# EAGLE design internal_breakout (EAGLE 9.6.1)
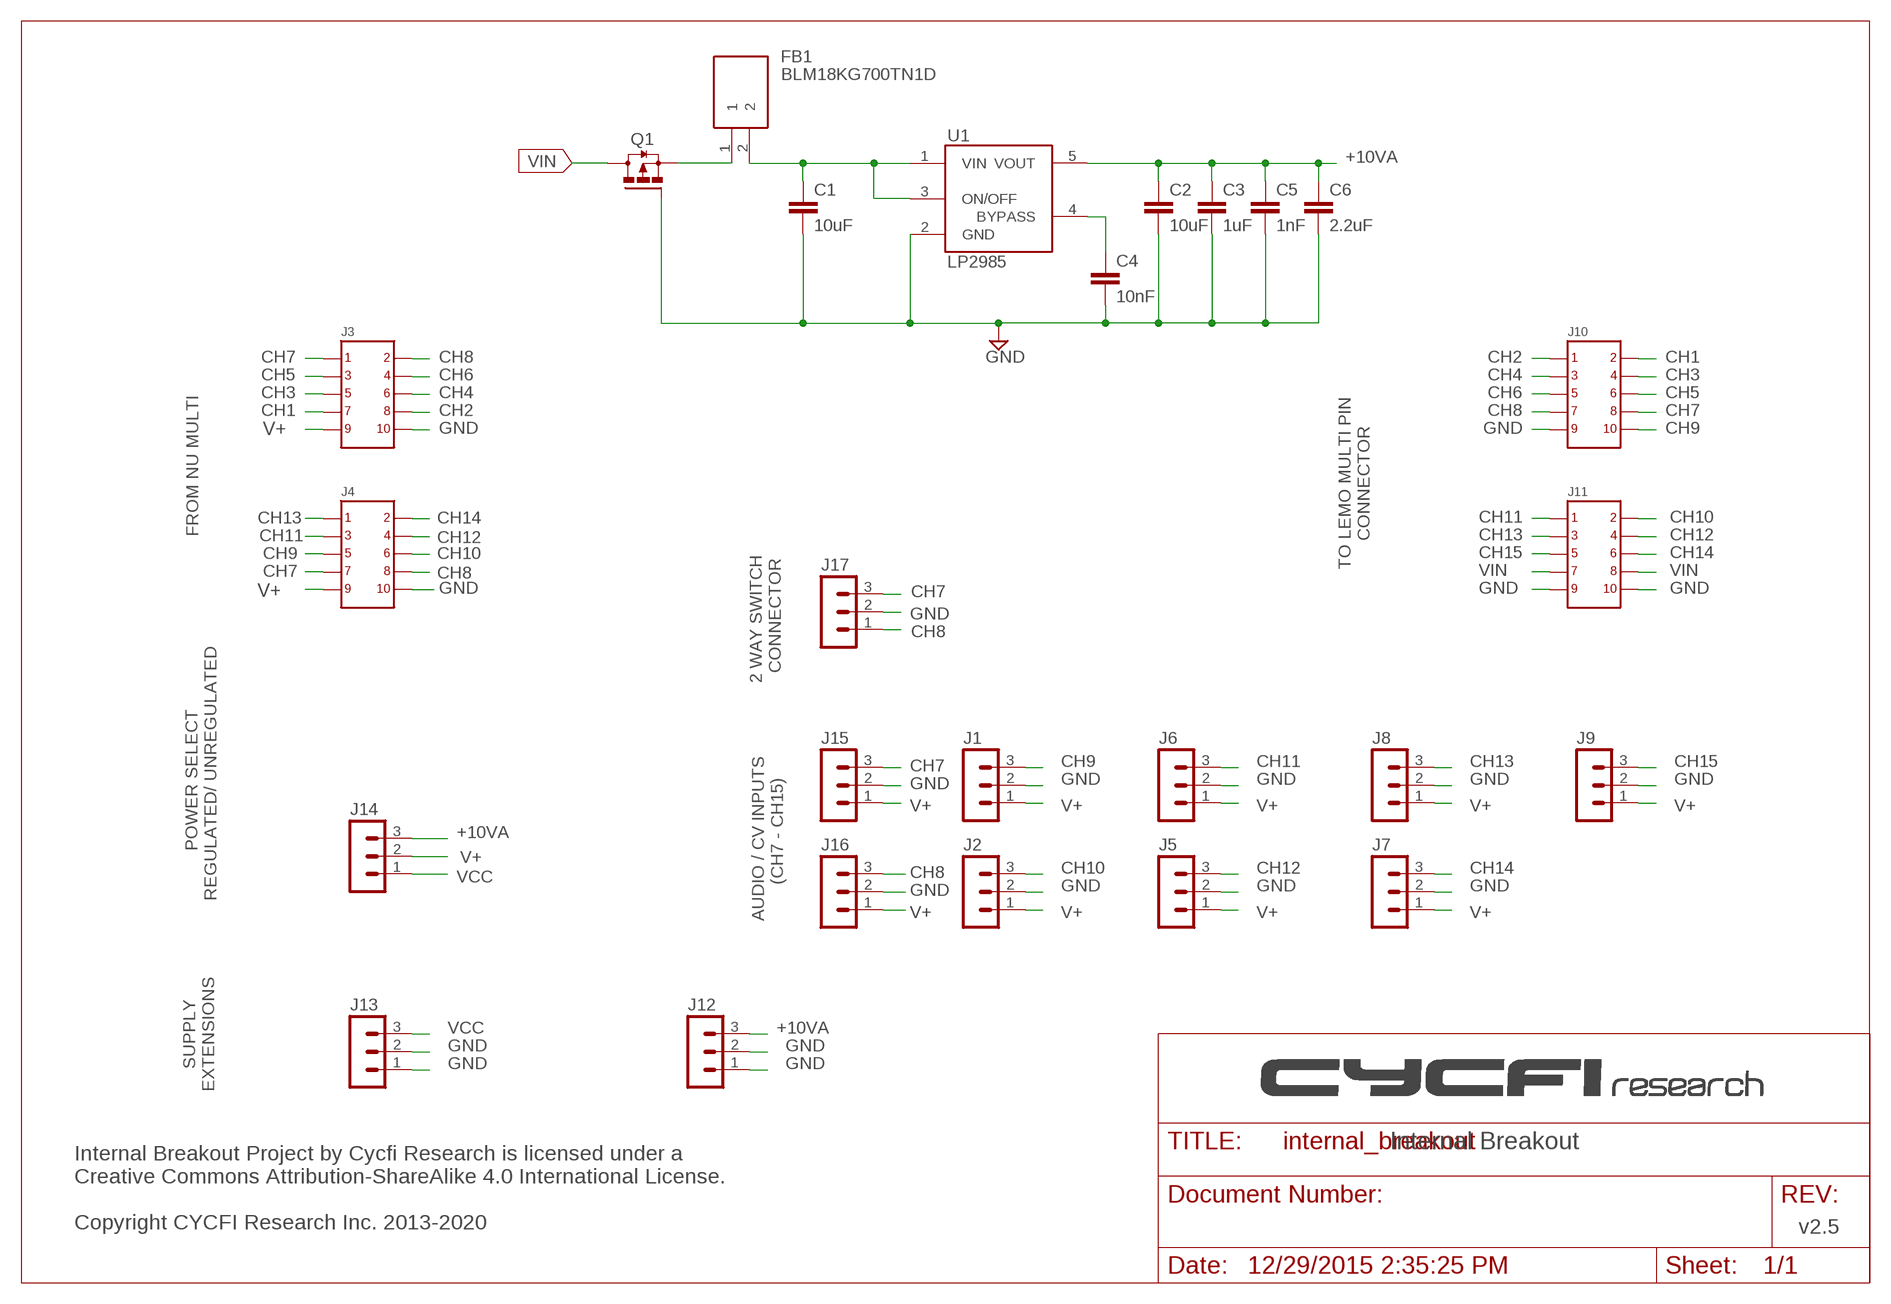
[diagram p0: schematic, sheet 1]

## Parts
C1  10uF  C-EUC0603  [C0603]
C2  10uF  C-EUC0603  [C0603]
C3  1uF  C-EUC0603  [C0603]
C4  10nF  C-EUC0402  [C0402]
C5  1nF  C-EUC0402  [C0402]
C6  2.2uF  C-EUC0603  [C0603]
FB1  BLM18KG700TN1D  [BEADC1608X75N]
J1  MA03-1  [MA03-1]
J2  MA03-1  [MA03-1]
J3  2X5  [2X5]
J4  2X5  [2X5]
J5  MA03-1  [MA03-1]
J6  MA03-1  [MA03-1]
J7  MA03-1  [MA03-1]
J8  MA03-1  [MA03-1]
J9  MA03-1  [MA03-1]
J10  2X5  [2X5]
J11  2X5  [2X5]
J12  MA03-1  [MA03-1]
J13  MA03-1  [MA03-1]
J14  MA03-1  [MA03-1]
J15  MA03-1  [MA03-1]
J16  MA03-1  [MA03-1]
J17  MA03-1  [MA03-1]
Q1  DMP3099L  FDN360P  [SUPER-SOT3]
U1  LP2985  LP2985AIM5-3.3  [SOT25]

## Nets
+10VA: C2.1 C3.1 C5.1 C6.1 J12.3 J14.3 U1.5(VOUT)
BYPASS: C4.1 U1.4(BYPASS)
CH1: J3.7 J10.2
CH2: J3.8 J10.1
CH3: J3.5 J10.4
CH4: J3.6 J10.3
CH5: J3.3 J10.6
CH6: J3.4 J10.5
CH7: J3.1 J4.7 J10.8 J15.3 J17.3
CH8: J3.2 J4.8 J10.7 J16.3 J17.1
CH9: J1.3 J4.5 J10.10
CH10: J2.3 J4.6 J11.2
CH11: J4.3 J6.3 J11.1
CH12: J4.4 J5.3 J11.4
CH13: J4.1 J8.3 J11.3
CH14: J4.2 J7.3 J11.6
CH15: J9.3 J11.5
GND: C1.2 C2.2 C3.2 C4.2 C5.2 C6.2 J1.2 J2.2 J3.10 J4.10 J5.2 J6.2 J7.2 J8.2 J9.2 J10.9 J11.9 J11.10 J12.1 J12.2 J13.1 J13.2 J15.2 J16.2 J17.2 Q1.1(G) U1.2(GND)
N$1: FB1.1 Q1.2(S)
V+: J1.1 J2.1 J3.9 J4.9 J5.1 J6.1 J7.1 J8.1 J9.1 J14.2 J15.1 J16.1
VCC: C1.1 FB1.2 J13.3 J14.1 U1.1(VIN) U1.3(ON/OFF)
VIN: J11.7 J11.8 Q1.3(D)

## Notes on the sheet
- CH7 | CH8
- CH5 | CH6
- CH3 | CH4
- CH1 | CH2
- GND
- TO LEMO MULTI PIN
  CONNECTOR
- FROM NU MULTI
- GND
- 2 WAY SWITCH 
    CONNECTOR
- AUDIO / CV INPUTS
     (CH7 - CH15)
- POWER SELECT 
  REGULATED/ UNREGULATED
- SUPPLY
  EXTENSIONS
- Internal Breakout
- Internal Breakout Project by Cycfi Research is licensed under a 
  Creative Commons Attribution-ShareAlike 4.0 International License. 
  
  Copyright CYCFI Research Inc. 2013-2020
- v2.5
- 12/29/2015 2:35:25 PM

## Library data of the parts
C1-C6 = rcl:C-EU: CAPACITOR, European symbol; SPICEPREFIX: C
FB1 = SamacSys_Parts:BLM18KG700TN1D: BLM18_N1D Series EMI Suppression Filter 70+/-25% at 100MHz 3.5A @85 Source: Datasheet <https://componentsearchengine.com/Datasheets/1/BLM18KG700TN1D.pdf>; DESCRIPTION: BLM18_N1D Series EMI Suppression Filter 70+/-25% at 100MHz 3.5A @85; HEIGHT: 0.75mm; MANUFACTURER_NAME: Murata Electronics; MANUFACTURER_PART_NUMBER: BLM18KG700TN1D; MOUSER_PART_NUMBER: 81-BLM18KG700TN1D; MOUSER_PRICE-STOCK: https://www.mouser.com/Search/Refine.aspx?Keyword=81-BLM18KG700TN1D
J1 J2 J5-J9 J12-J17 = con-lstb:MA03-1: PIN HEADER; OC_FARNELL: unknown; OC_NEWARK: unknown
J3 J4 J10 J11 = headers(2mm):2X5
Q1 = transistor-power:FDN360P: Single P-Channel, PowerTrench (R) MOSFET Source: http://www.fairchildsemi.com/ds/FD/FDN360P.pdf
U1 = LP2985:LP2985: LP2985-N Micropower 150 mA Low-Noise Ultra Low-Dropout Regulator

## Board
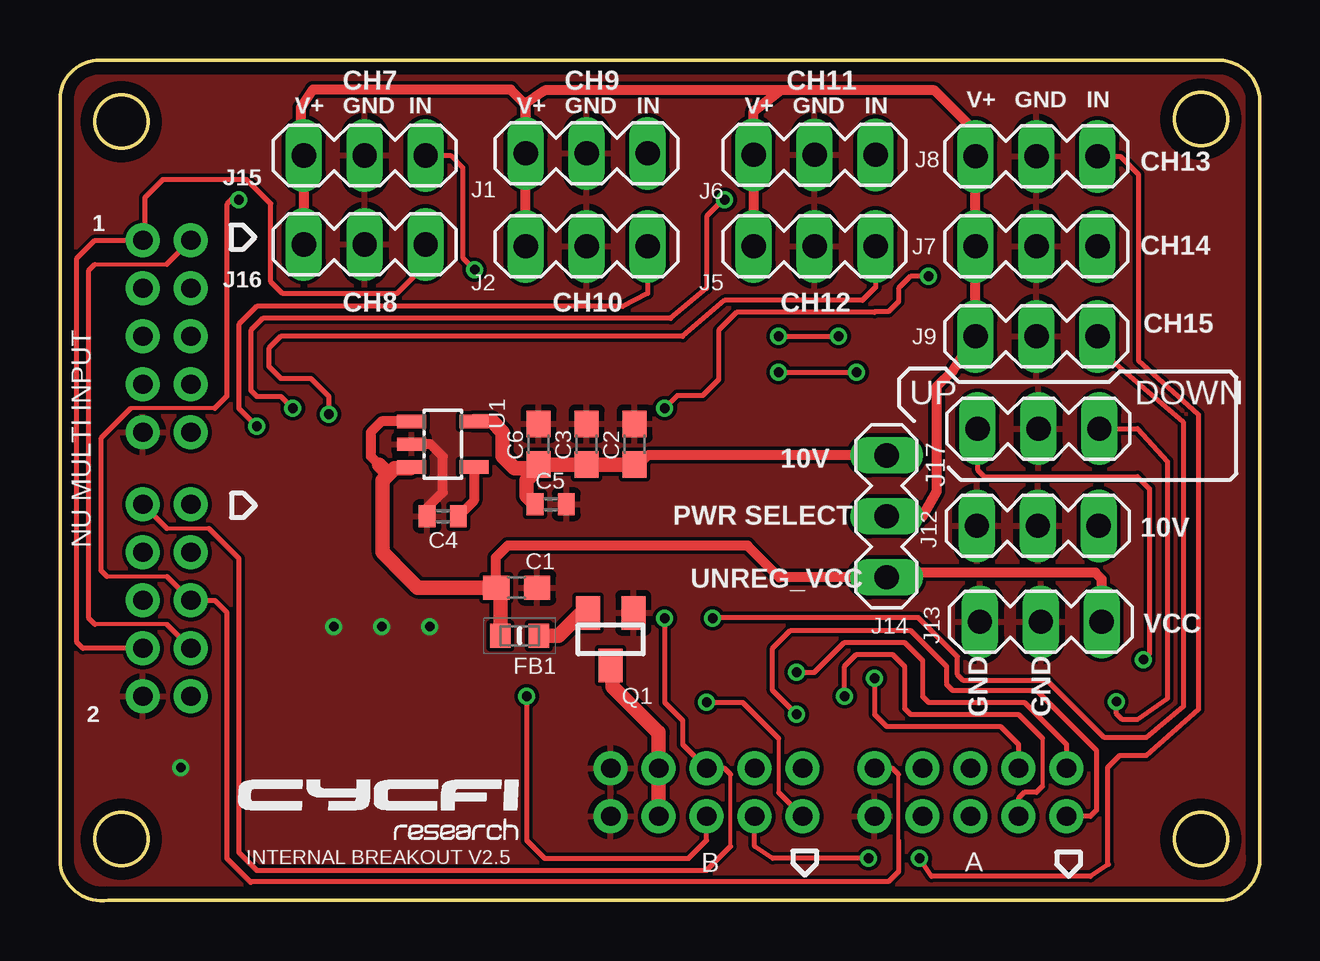
[diagram p1: board, top side]
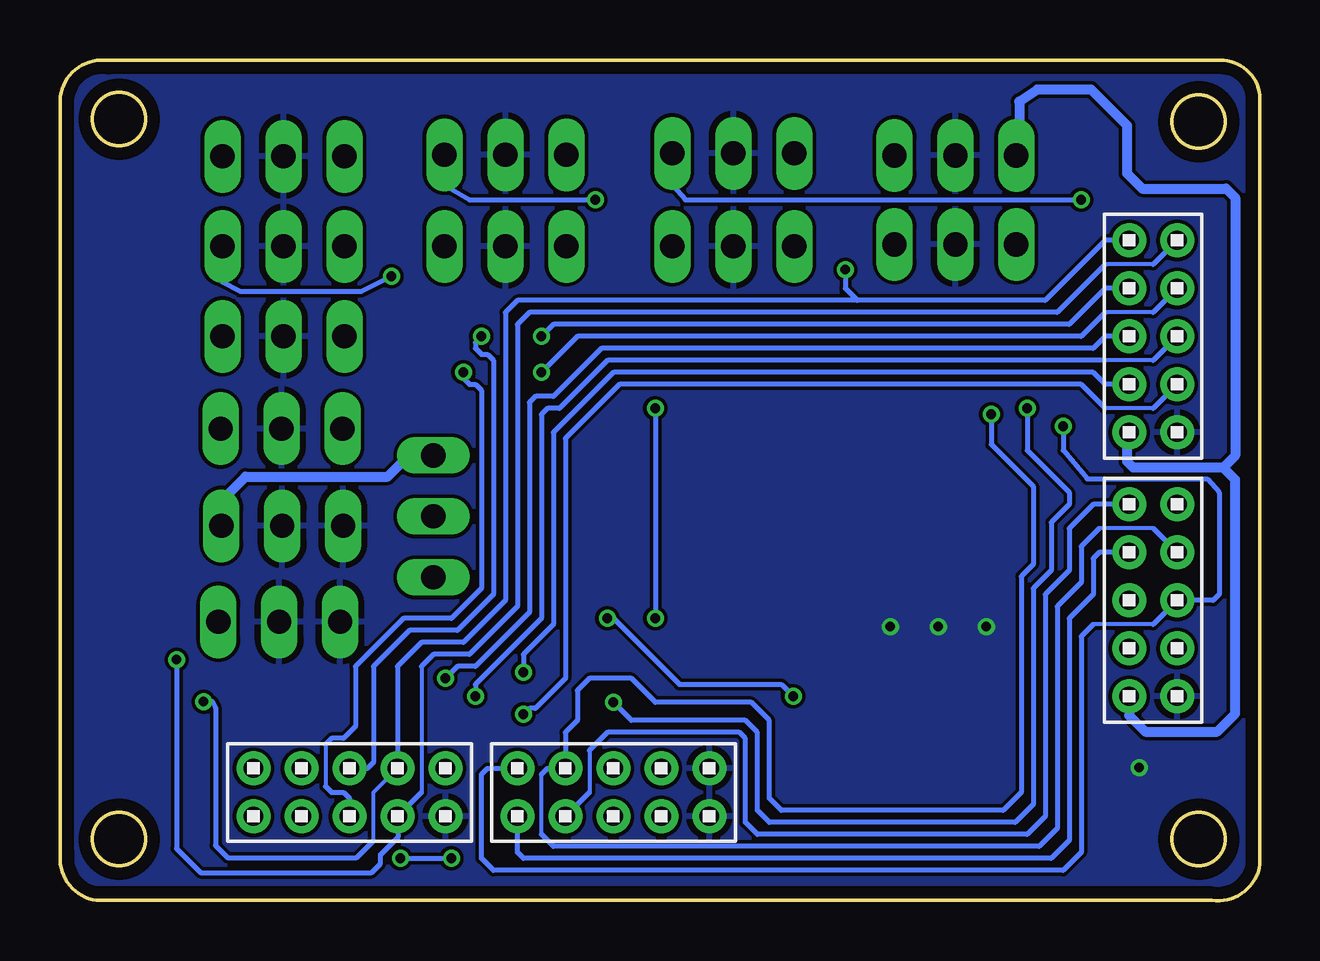
[diagram p2: board, bottom side, seen from below]

Size 50.02 x 35.03 mm. Coordinates in mm from the lower left corner, seen from the top.
Outline: 1.5,35.02 48,35.02 arc-90 50,33.52 50,2.02 arc-90 48.5,0.02 2,0.02 arc-90 0,1.52 0,33.27 arc-90 1.5,35.02
Outline: circle at 2.55,32.47 radius 1.1
Outline: circle at 2.55,2.57 radius 1.1
Outline: circle at 47.55,32.57 radius 1.1
Outline: circle at 47.55,2.57 radius 1.1
Copper layers (1*16): Top 0.035mm / dielectric 1.6mm / Bottom 0.035mm
Design rules "Elecrow_2-layer_PCB_eagle_rule": minimum track width 6mil, minimum drill 12mil, track to track 6mil, track to pad 8mil, pad to pad 12mil, via to via 12mil, smd to smd 0mil, copper to edge 20mil, drill to drill 10mil, minimum pad ring 6mil, minimum via ring 6mil, stop-mask expansion 0mil, vias tented up to drill 100mil, thermal gap 10mil

### Footprints (pad centres in the part's own frame; a part is rotated, then mirrored left to right if it is on the bottom)
C0603 = smd 1.1 x 1: 1 -0.85,0; 2 0.85,0
C0402 = smd 0.7 x 0.9: 1 -0.65,0; 2 0.65,0
BEADC1608X75N = smd 0.85 x 1: 1 -0.8,0; 2 0.8,0
MA03-1 = drill 1.016 long: 1 -2.54,0; 2 0,0; 3 2.54,0
2X5 = drill 0.8 pad 1.422: 1 -4,-1; 2 -4,1; 3 -2,-1; 4 -2,1; 5 0,-1; 6 0,1; 7 2,-1; 8 2,1; 9 4,-1; 10 4,1
SUPER-SOT3 = smd 1 x 1.4: 1 -0.95,-1.1; 2 0.95,-1.1; 3 0,1.1
SOT25 = smd 0.55 x 1.2: 1 -0.95,-1.3; 2 0,-1.3; 3 0.95,-1.3; 4 0.95,1.3; 5 -0.95,1.3

### Placement (x,y rotation side)
C1  19.03,13.04 0 top
C2  23.95,19.02 90 top
C3  21.95,19.02 90 top
C4  15.95,16.02 180 top
C5  20.45,16.52 0 top
C6  19.95,19.02 90 top
FB1  19.16,11.04 180 top
J1  21.95,31.15 0 top
J2  21.95,27.27 0 top
J3  4.45,23.52 270 bottom
J4  4.45,12.52 270 bottom
J5  31.45,27.27 0 top
J6  31.45,31.08 0 top
J7  40.7,27.27 0 top
J8  40.7,31.02 0 top
J9  40.7,23.52 0 top
J10  37.95,4.52 0 bottom
J11  26.95,4.52 0 bottom
J12  40.76,15.62 0 top
J13  40.88,11.62 0 top
J14  34.45,16.02 90 top
J15  12.7,31.05 0 top
J16  12.7,27.35 0 top
J17  40.78,19.67 0 top
Q1  22.95,10.9 180 top
U1  15.95,19.02 270 top

### Tracks (layer width: path | path; a pad name or v marks a point on that pad's centre or on a via)
+10VA
  Top 0.406: 24.1,18.17 24.49,18.56 J14.3
  Top 0.61: U1.5 18,19.97 18.45,19.52 18.45,18.52 18.95,18.02 19.8,18.02 C6.1 | C6.1 C3.1 C2.1 24.1,18.17 | C6.1 19.95,18.02 19.45,17.52 19.45,16.87 C5.1
  Bottom 0.406: J14.3 34.47,18.54 34.89,18.54 34.91,18.52 35.51,18.52 | 35.51,18.52 35.53,18.54 | J12.3 43.3,16.65 42.28,17.67 36.36,17.67 35.51,18.52
BYPASS
  Top 0.406: U1.4 17.25,16.67 C4.1
CH1  (via drill 0.4)
  Top 0.203: v30.7,9.52 31.45,9.52 32.7,10.77 35.2,10.77 35.95,10.02 35.95,8.52 36.2,8.27 40.2,8.27 41.95,6.52 J10.2
  Bottom 0.203: J3.7 6.45,21.52 6.95,22.02 26.95,22.02 29.45,19.52 29.45,11.52 30.7,10.27 v30.7,9.52
CH2  (via drill 0.4)
  Top 0.203: v30.7,7.77 29.7,8.77 29.7,10.52 30.45,11.27 35.45,11.27 36.95,9.77 36.95,9.02 37.2,8.77 40.7,8.77 43.2,6.27 43.2,3.77 42.95,3.52 J10.1
  Bottom 0.17: 4.45,20.52 6.45,20.52
  Bottom 0.203: J3.8 4.45,20.52 | 6.45,20.52 7.45,21.52 26.7,21.52 28.95,19.27 28.95,9.27 30.2,8.02 30.45,8.02 v30.7,7.77
CH3  (via drill 0.4)
  Top 0.203: v33.95,9.27 33.95,7.77 34.45,7.27 39.2,7.27 39.95,6.52 J10.4
  Bottom 0.203: J3.5 6.45,23.52 6.95,23.02 27.45,23.02 29.45,21.02 30.2,21.02 30.45,20.77 30.45,12.02 32.7,9.77 33.45,9.77 v33.95,9.27
CH4  (via drill 0.4)
  Top 0.17: 40.95,6.77 40.95,4.77
  Top 0.203: v32.7,8.52 32.7,9.77 33.2,10.27 34.7,10.27 35.2,9.77 35.2,8.02 35.45,7.77 39.95,7.77 40.95,6.77 | 40.95,4.77 40.7,4.52 40.2,4.52 39.95,4.27 J10.3
  Bottom 0.17: 4.45,22.52 6.45,22.52
  Bottom 0.203: J3.6 4.45,22.52 | v32.7,8.52 32.7,9.02 29.95,11.77 29.95,20.27 29.7,20.52 29.2,20.52 27.2,22.52 6.45,22.52
CH5  (via drill 0.4)
  Top 0.203: v29.95,23.52 v32.45,23.52
  Bottom 0.203: J3.3 6.45,25.52 7.95,24.02 29.45,24.02 v29.95,23.52 | v32.45,23.52 32.7,23.27 32.7,23.02 32.45,22.77 32.2,22.77 31.95,22.52 31.95,12.77 33.45,11.27 35.45,11.27 36.95,9.77 36.95,5.77 37.2,5.52 J10.6
CH6  (via drill 0.4)
  Top 0.203: v29.95,22.02 v33.2,22.02
  Bottom 0.17: 38.95,6.52 38.95,4.77 | 4.45,24.52 6.45,24.52
  Bottom 0.203: J3.4 4.45,24.52 | 6.45,24.52 7.45,23.52 28.45,23.52 v29.95,22.02 | v33.2,22.02 33.2,21.77 32.95,21.52 32.7,21.52 32.45,21.27 32.45,13.02 33.7,11.77 35.7,11.77 37.7,9.77 37.7,7.27 38.2,6.77 38.7,6.77 38.95,6.52 | 38.95,4.77 38.7,4.52 38.2,4.52 37.95,4.27 J10.5
CH7  (via drill 0.4)
  Top 0.17: 4.45,11.52 1.45,11.52 | 1.45,26.52 4.45,26.52
  Top 0.203: J4.7 4.45,11.52 | 1.45,11.52 1.2,11.77 1.2,26.27 1.45,26.52 | 4.45,26.52 J3.1 | J15.3 16.28,31.05 16.78,30.54 16.78,26.79 v17.28,26.29 | J17.3 44.91,19.67 46.16,18.29 46.16,8.42 44.91,7.54 44.28,7.54 44.03,7.79 v44.03,8.29
  Bottom 0.17: 36.95,2.5 36.95,4.52 J10.8
  Bottom 0.203: J3.1 6.45,27.52 8.95,25.02 16.78,25.02 | 16.78,25.02 30.95,25.02 31.45,24.52 31.45,12.52 33.2,10.77 34.95,10.77 35.95,9.77 J10.8 | v17.28,26.29 17.28,25.52 16.78,25.02 | v44.03,8.29 43.66,8.29 43.53,8.04 43.53,2.29 43.03,1.79 37.66,1.79 36.95,2.5
CH8  (via drill 0.4)
  Top 0.203: J4.8 0.95,10.52 0.7,10.77 0.7,26.77 1.45,27.52 J3.2 3.53,27.6 3.53,29.29 4.28,30.04 7.78,30.04 8.78,29.04 8.78,25.79 9.28,25.29 14.03,25.29 15.24,26.5 J16.3 | J17.1 38.24,17.96 38.53,17.67 44.91,17.67 45.41,17.17 45.41,10.29 v45.16,10.04
  Bottom 0.17: 34.95,9.77 34.95,4.52 | 4.45,26.52 6.45,26.52
  Bottom 0.203: J3.2 4.45,26.52 | 6.45,26.52 8.45,24.52 30.45,24.52 30.95,24.02 30.95,12.27 32.95,10.27 34.45,10.27 34.95,9.77 | 34.95,4.52 J10.7 35.91,3.47 35.91,2.67 36.66,1.92 36.66,1.54 37.03,1.17 44.16,1.17 45.16,2.17 v45.16,10.04
CH9  (via drill 0.4)
  Top 0.17: 6.45,20.52 2.95,20.52 | 1.95,13.52 4.45,13.52 | 34.95,2.52 34.95,5.27
  Top 0.203: v7.45,29.21 7.2,29.27 6.95,29.02 6.95,21.02 6.45,20.52 | 2.95,20.52 1.7,19.27 1.7,13.77 1.95,13.52 | 4.45,13.52 J4.5 6.45,12.52 6.95,12.02 6.95,1.77 7.95,0.77 7.98,0.79 34.53,0.79 34.95,1.21 34.95,2.52 | 34.95,5.27 34.7,5.52 J10.10
  Bottom 0.203: J1.3 24.49,29.81 23.95,29.21 v7.45,29.21
CH10  (via drill 0.4)
  Top 0.203: J2.3 24.49,25.31 23.45,24.77 8.2,24.77 7.45,24.02 7.45,20.52 v8.2,19.77
  Bottom 0.17: 4.45,11.52 6.95,11.52
  Bottom 0.203: 4.45,11.52 J4.6 1.95,12.52 1.7,12.77 1.7,17.02 2.2,17.58 7.2,17.58 8.2,18.77 v8.2,19.77 | 6.95,11.52 7.45,11.02 7.45,2.02 8.2,1.27 31.95,1.27 32.45,1.77 32.45,5.27 32.2,5.52 J11.2
CH11  (via drill 0.4)
  Top 0.17: 29.95,6.77 29.95,4.52
  Top 0.203: v27.7,29.21 27.45,29.02 26.95,28.52 26.95,25.52 25.45,24.27 8.45,24.27 7.95,23.77 7.95,21.27 8.2,21.02 9.2,21.02 v9.7,20.52 | v26.95,8.27 28.45,8.27 29.95,6.77 | 29.95,4.52 J11.1
  Bottom 0.203: J4.3 6.7,14.52 6.95,14.27 6.95,12.77 7.95,11.77 7.95,2.52 8.7,1.77 30.7,1.77 30.95,2.02 J11.1 | J6.3 33.99,29.81 32.95,29.21 v27.7,29.21 | v9.7,20.52 9.7,18.77 7.95,17.02 7.95,16.52 8.7,15.77 8.7,13.77 9.45,13.02 9.45,4.02 10.2,3.27 20.45,3.27 20.95,3.77 20.95,7.02 21.45,7.52 26.2,7.52 v26.95,8.27
CH12  (via drill 0.4)
  Top 0.203: J5.3 33.99,25.56 33.45,25.02 27.7,25.02 25.95,23.52 9.2,23.52 8.7,23.02 8.7,22.27 9.2,21.77 10.45,21.77 11.2,21.02 v11.2,20.27
  Bottom 0.17: 4.45,15.52 6.7,15.52 | 29.95,2.77 29.95,5.27
  Bottom 0.203: J4.4 4.45,15.52 | 6.7,15.52 7.45,14.77 7.45,13.27 8.45,12.27 8.45,3.02 9.2,2.27 29.45,2.27 29.95,2.77 | 29.95,5.27 29.7,5.52 J11.4 28.95,7.02 28.45,7.52 28.45,8.77 27.95,9.27 26.2,9.27 25.2,8.27 21.2,8.27 20.45,7.52 20.45,4.27 19.95,3.77 10.7,3.77 9.95,4.52 9.95,13.52 9.45,14.02 9.45,17.27 11.2,19.02 v11.2,20.27
CH13  (via drill 0.4)
  Top 0.203: J8.3 44.2,31.02 44.95,30.27 44.95,22.52 47.45,20.27 47.45,7.96 45.28,6.04 44.16,6.04 43.66,5.54 43.66,1.57 43.7,1.52 42.95,1.02 36.33,1.02 v35.83,1.77 | v33.7,1.77 29.7,1.77 28.95,2.27 J11.3
  Bottom 0.17: 27.95,6.27 27.95,4.52
  Bottom 0.203: J4.1 6.95,16.52 7.95,15.52 7.95,13.77 8.95,12.77 8.95,3.52 9.7,2.77 20.95,2.77 21.45,3.27 21.45,6.77 21.7,7.02 27.2,7.02 27.95,6.27 | 27.95,4.52 J11.3 | v35.83,1.77 v33.7,1.77
CH14  (via drill 0.4)
  Top 0.17: 4.45,15.52 6.2,15.52 | 27.95,2.27 27.95,5.27
  Top 0.203: J4.2 4.45,15.52 | 6.2,15.52 7.45,14.27 7.45,2.02 8.2,1.27 26.95,1.27 27.95,2.27 | 27.95,5.27 27.7,5.52 J11.6 25.95,6.52 25.95,7.52 25.2,8.27 v25.2,11.77 | v36.2,26.02 35.45,26.02 34.95,25.52 34.95,24.96 34.53,24.54 33.98,24.54 33.95,24.52 28.2,24.52 27.45,23.77 27.45,21.71 26.78,21.04 25.73,21.04 v25.2,20.52
  Bottom 0.203: v36.2,26.02 37.45,25.39 42.51,25.39 43.28,25.79 43.28,27.23 J7.3 | v25.2,20.52 v25.2,11.77
CH15  (via drill 0.4)
  Top 0.203: v19.45,8.52 19.45,2.52 20.2,1.77 26.2,1.77 26.95,2.52 J11.5 | J9.3 43.28,22.98 46.83,19.93 46.83,8.09 45.28,6.79 43.53,6.79 41.16,9.17 37.66,9.17 37.41,9.42 37.41,10.17 35.78,11.79 27.23,11.79 v27.2,11.77
  Bottom 0.203: v27.2,11.77 26.95,11.77 24.2,9.02 19.95,9.02 v19.45,8.52
GND  (via drill 0.4)
  Top 0.406: C4.2 15.3,16.37 15.95,17.02 15.95,18.52 15.45,19.02 U1.2
  other vias: 11.41,11.42 13.41,11.42 15.41,11.42 5.03,5.54
  pour Bottom: -0.05,0.02 -0.05,35.02 49.95,35.02 49.95,0.02
  pour Top: -0.05,0.02 -0.05,35.02 49.95,35.02 49.95,0.02
N$1
  Top 0.61: Q1.2 21.73,11.99 20.78,11.04 FB1.1
V+
  Top 0.406: J14.2 35.95,16.02 36.53,17.04 36.53,21.42 37.2,22.06 J9.1 J7.1 J8.1 38.16,32.06 36.45,33.77 30.03,33.77 | 30.03,33.77 20.2,33.77 19.41,33.23 J1.1 | J5.1 J6.1 28.91,32.9 30.03,33.77 | J2.1 J1.1 | J16.1 J15.1 10.03,31.18 10.03,33.04 10.53,33.79 18.78,33.79 19.41,33.16 J1.1
  Bottom 0.406: J4.9 5.45,7.71 4.78,7.04 1.78,7.04 1.03,7.79 1.03,17.54 1.53,18.04 | 1.53,18.04 5.28,18.04 5.53,18.29 5.53,19.44 J3.9 | 1.53,18.04 1.03,18.54 1.03,29.29 1.41,29.67 4.91,29.67 5.53,30.29 5.53,32.29 7.03,33.79 9.28,33.79 10.03,33.29 10.03,31.18 J15.1
VCC
  Top 0.406: U1.1 13.4,19.97 12.95,19.52 12.95,18.52 13.3,18.17 | C1.1 18.16,13.07 18.16,14.29 18.66,14.79 28.66,14.79 29.97,13.48 J14.1 34.64,13.67 43.16,13.67 43.42,13.4 J13.3
  Top 0.61: 13.7,17.77 13.45,17.52 13.45,14.52 13.95,14.02 13.95,14 14.91,13.04 C1.1 18.36,12.87 FB1.2 | 13.7,17.77 13.95,18.02 14.6,18.02 U1.3 | 13.3,18.17 13.7,17.77
VIN
  Top 0.61: J11.7 J11.8 24.95,7.02 24.93,7.02 23.03,8.92 23.03,9.72 Q1.3

### Text on the board
tPlace: CH7 | CH9 | CH11 | V+ | GND | IN | V+ | GND | IN | V+ | GND | IN | V+ | GND | IN | J15 | CH13 | 1 | CH14 | J16 | CH8 | CH10 | CH12 | CH15 | 10V | PWR SELECT | 10V | UNREG_VCC | VCC | GND | GND | 2
tNames: UP | DOWN | NU MULTI INPUT | B | A | INTERNAL BREAKOUT V2.5